# Altium project STM32F407_Board.PrjPcb (part 3 of 3)

## Sheet [9]-STM32F407.SchDoc
size A3; Organization: Altium Limited; Address1: L3, 12a Rodborough Rd; Address2: Frenchs Forest; Address3: NSW; Address4: Australia 2086
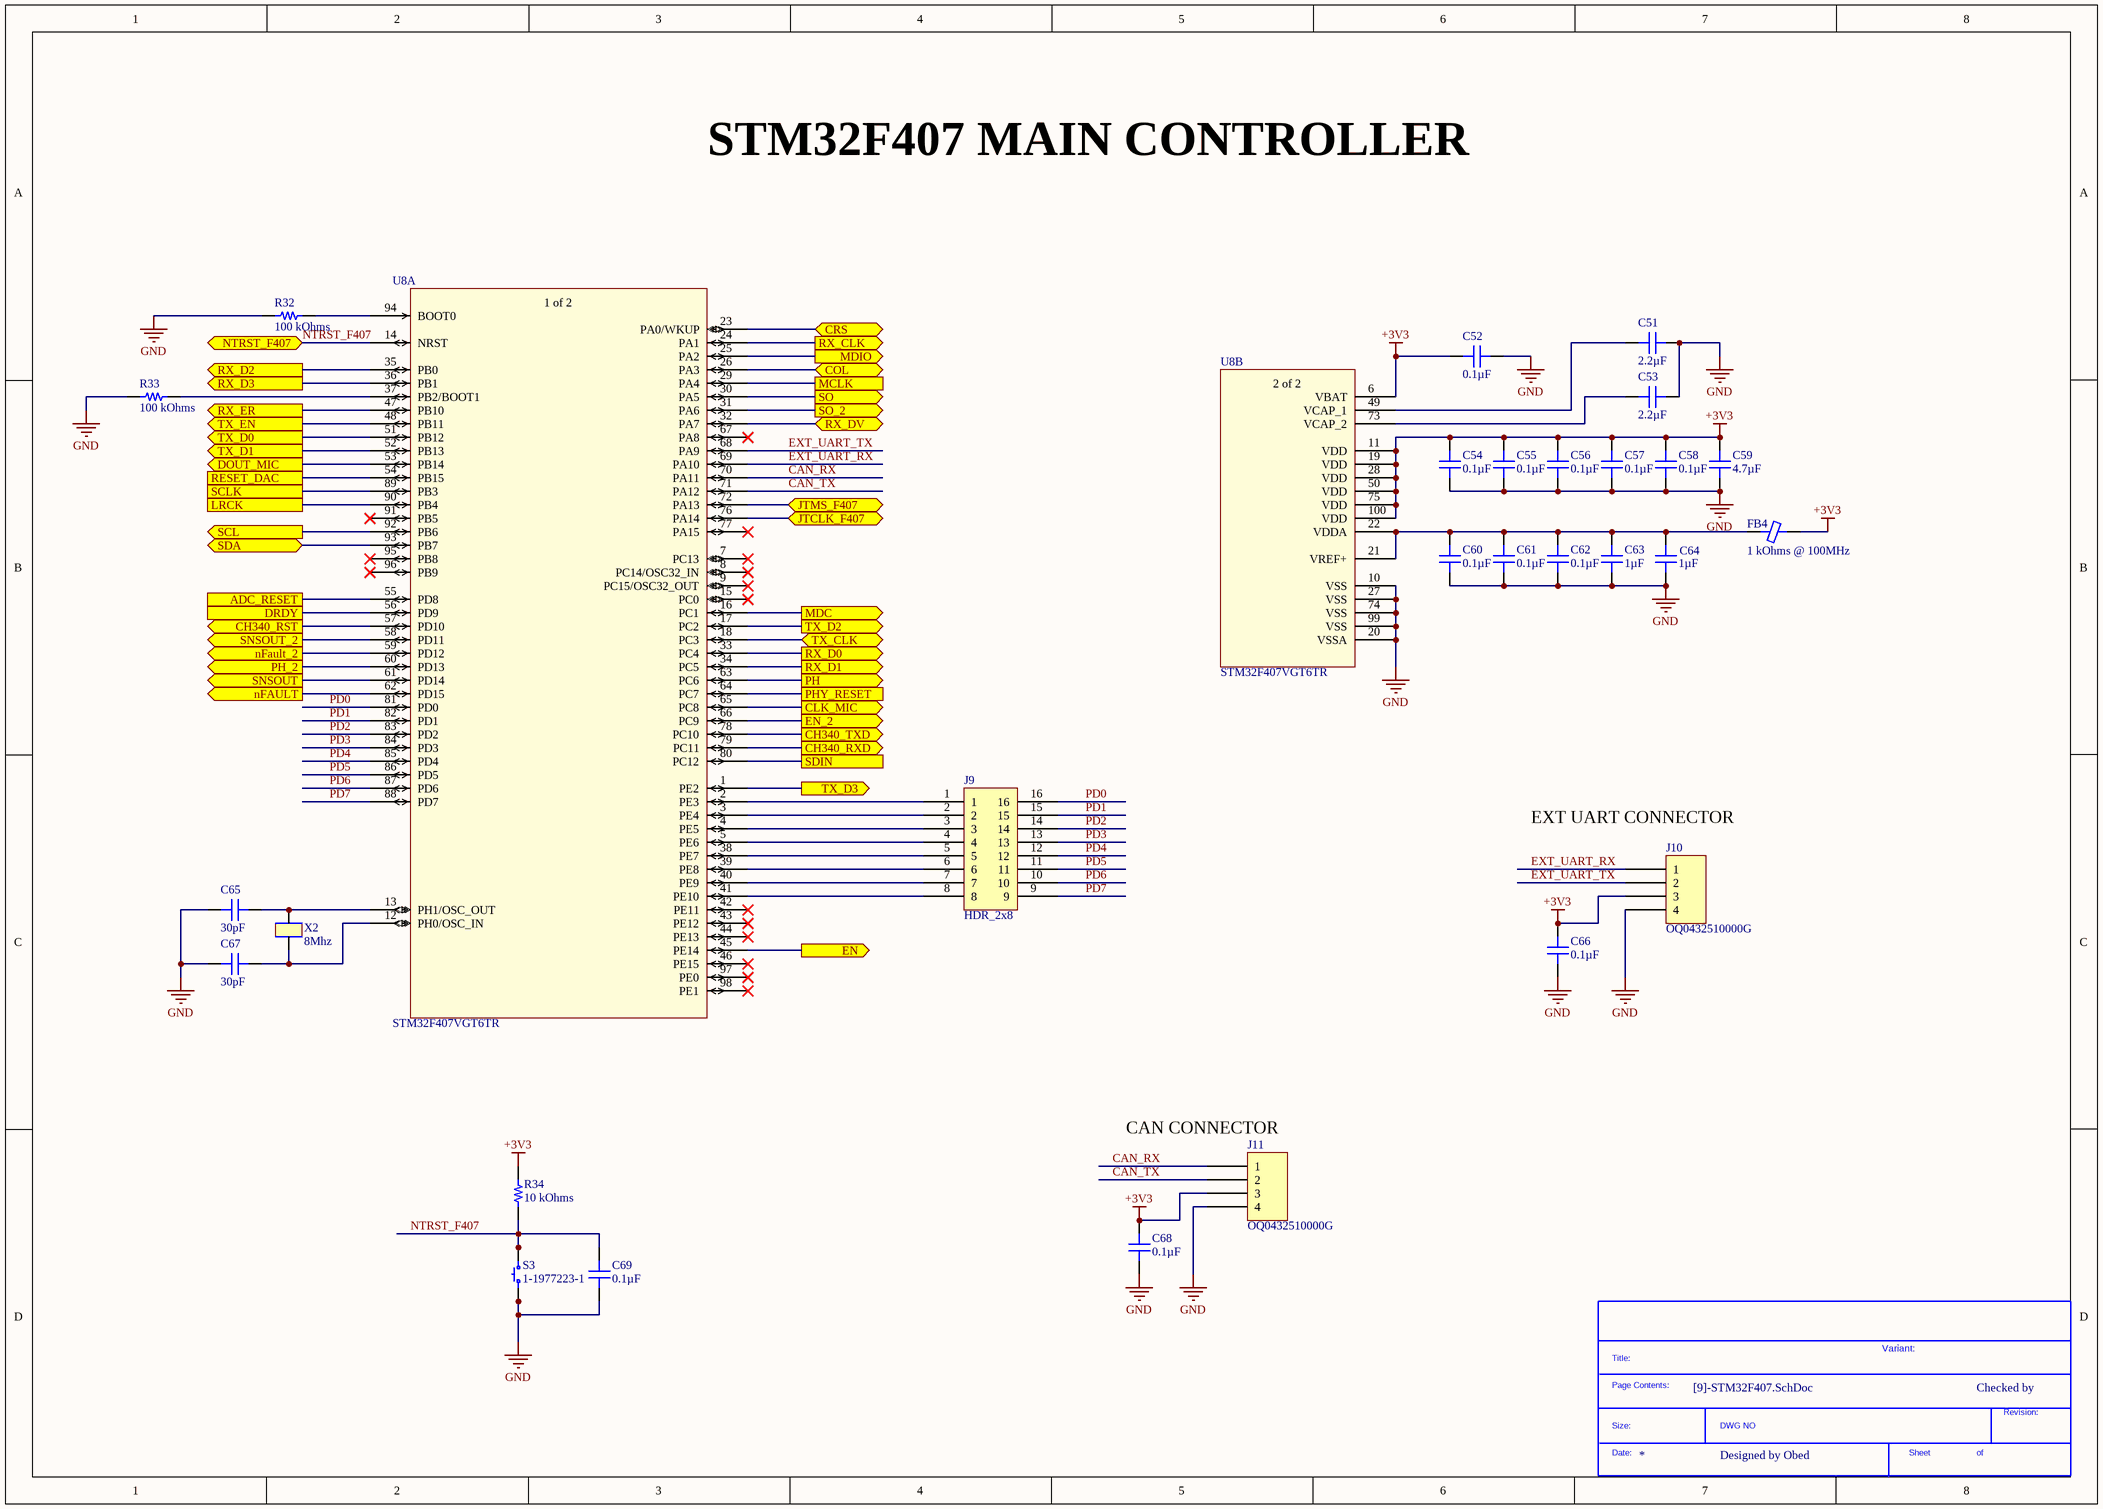
[diagram p8: [9]-STM32F407.SchDoc]

### Parts
(Parts that share a designator on the sheet are numbered #1, #2 ... from top to bottom, then left to right.)
*?#9  SDTitleBlock  (value not drawn)  (graphical)
C51  2.2µF  [CAP 0805_2012]
C52  0.1µF  [CAP 0805_2012]
C53  2.2µF  [CAP 0805_2012]
C54  0.1µF  [CAP 0805_2012]
C55  0.1µF  [CAP 0805_2012]
C56  0.1µF  [CAP 0805_2012]
C57  0.1µF  [CAP 0805_2012]
C58  0.1µF  [CAP 0805_2012]
C59  4.7µF  [CAP 0805_2012]
C60  0.1µF  [CAP 0805_2012]
C61  0.1µF  [CAP 0805_2012]
C62  0.1µF  [CAP 0805_2012]
C63  1µF  [CAP 0805_2012]
C64  1µF  [CAP 0805_2012]
C65  30pF  [CAP 0805_2012]
C66  0.1µF  [CAP 0805_2012]
C67  30pF  [CAP 0805_2012]
C68  0.1µF  [CAP 0805_2012]
C69  0.1µF  [CAP 0805_2012]
FB4  1 kOhms @ 100MHz  [FER 1206_3216]
J9  HDR_2x8  [HDR_2x8]
J10  OQ0432510000G  [FCI 06-381-4PIN]
J11  OQ0432510000G  [FCI 06-381-4PIN]
R32  100 kOhms  [RES 0603_1608]
R33  100 kOhms  [RES 0805_2012]
R34  10 kOhms  [RES 0805_2012]
S3  1-1977223-1  [TE FSM4JSMA]
U8  STM32F407VGT6TR  [QFN100_19.6_669_58X10_SMD]  (parts A,B of 2)
X2  8Mhz  [XTAL_314_240X47_SMD]

### Ports
ADC_RESET, CH340_RST (out), CH340_RXD (out), CH340_TXD (out), CLK_MIC (out), COL (bidir), CRS (bidir), DOUT_MIC (out), DRDY, EN (out), EN_2 (out), JTCLK_F407 (bidir), JTMS_F407 (bidir), LRCK, MCLK, MDC (out), MDIO (out), nFAULT (out), nFault_2 (out), NTRST_F407 (bidir), PH (out), PH_2 (out), PHY_RESET, RESET_DAC, RX_CLK (out), RX_D0 (out), RX_D1 (out), RX_D2 (out), RX_D3 (out), RX_DV (bidir), RX_ER (out), SCL (out), SCLK, SDA (bidir), SDIN, SNSOUT (out), SNSOUT_2 (out), SO (out), SO_2 (out), TX_CLK (bidir), TX_D0 (out), TX_D1 (out), TX_D2 (out), TX_D3 (out), TX_EN (out)

### Nets
+3V3: C52.1 C54.1 C55.1 C56.1 C57.1 C58.1 C59.2 C66.1 C68.1 FB4.2 J10.3 J11.3 R34.1 U8.6(VBAT) U8.11(VDD) U8.19(VDD) U8.28(VDD) U8.50(VDD) U8.75(VDD) U8.100(VDD)
GND: C51.2 C52.2 C53.2 C54.2 C55.2 C56.2 C57.2 C58.2 C59.1 C60.2 C61.2 C62.2 C63.1 C64.1 C65.1 C66.2 C67.1 C68.2 C69.1 J10.4 J11.4 R32.1 R33.1 S3.1 S3.2 U8.10(VSS) U8.20(VSSA) U8.27(VSS) U8.74(VSS) U8.99(VSS)
CAN_RX: J11.1 U8.70(PA11)
CAN_TX: J11.2 U8.71(PA12)
COL: U8.26(PA3) ; port COL
CRS: U8.23(PA0/WKUP) ; port CRS
EXT_UART_RX: J10.1 U8.69(PA10)
EXT_UART_TX: J10.2 U8.68(PA9)
NTRST_F407: C69.2 R34.2 S3.3 S3.4 U8.14(NRST) ; port NTRST_F407
PD0: J9.16 U8.81(PD0)
PD1: J9.15 U8.82(PD1)
PD2: J9.14 U8.83(PD2)
PD3: J9.13 U8.84(PD3)
PD4: J9.12 U8.85(PD4)
PD5: J9.11 U8.86(PD5)
PD6: J9.10 U8.87(PD6)
PD7: J9.9 U8.88(PD7)
PHY_RESET: U8.64(PC7) ; port PHY_RESET
NetC51_1: C51.1 U8.49(VCAP_1)
NetC53_1: C53.1 U8.73(VCAP_2)
NetC60_1: C60.1 C61.1 C62.1 C63.2 C64.2 FB4.1 U8.21(VREF+) U8.22(VDDA)
NetC65_2: C65.2 U8.13(PH1/OSC_OUT) X2.2
NetC67_2: C67.2 U8.12(PH0/OSC_IN) X2.1
NetJ9_1: J9.1 U8.2(PE3)
NetJ9_2: J9.2 U8.3(PE4)
NetJ9_3: J9.3 U8.4(PE5)
NetJ9_4: J9.4 U8.5(PE6)
NetJ9_5: J9.5 U8.38(PE7)
NetJ9_6: J9.6 U8.39(PE8)
NetJ9_7: J9.7 U8.40(PE9)
NetJ9_8: J9.8 U8.41(PE10)
NetR8_2: U8.25(PA2) ; port MDIO
NetR19_1: U8.45(PE14) ; port EN
NetR22_1: U8.62(PD15) ; port nFAULT
NetR23_1: U8.61(PD14) ; port SNSOUT
NetR24_2: U8.92(PB6) ; port SCL
NetR25_2: U8.93(PB7) ; port SDA
NetR26_1: U8.55(PD8) ; port ADC_RESET
NetR32_2: R32.2 U8.94(BOOT0)
NetR33_2: R33.2 U8.37(PB2/BOOT1)
NetR42_1: U8.66(PC9) ; port EN_2
NetR45_1: U8.59(PD12) ; port nFault_2
NetR46_1: U8.58(PD11) ; port SNSOUT_2
NetU1_18: U8.76(PA14) ; port JTCLK_F407
NetU1_25: U8.72(PA13) ; port JTMS_F407
NetU2_12: U8.16(PC1) ; port MDC
NetU2_13: U8.36(PB1) ; port RX_D3
NetU2_14: U8.35(PB0) ; port RX_D2
NetU2_15: U8.34(PC5) ; port RX_D1
NetU2_16: U8.33(PC4) ; port RX_D0
NetU2_18: U8.32(PA7) ; port RX_DV
NetU2_19: U8.24(PA1) ; port RX_CLK
NetU2_20: U8.47(PB10) ; port RX_ER
NetU2_22: U8.18(PC3) ; port TX_CLK
NetU2_23: U8.48(PB11) ; port TX_EN
NetU2_24: U8.51(PB12) ; port TX_D0
NetU2_25: U8.52(PB13) ; port TX_D1
NetU2_26: U8.17(PC2) ; port TX_D2
NetU2_27: U8.1(PE2) ; port TX_D3
NetU3_11: U8.30(PA5) ; port SO
NetU3_15: U8.63(PC6) ; port PH
NetU4_2: U8.78(PC10) ; port CH340_TXD
NetU4_3: U8.79(PC11) ; port CH340_RXD
NetU4_14: U8.57(PD10) ; port CH340_RST
NetU5_14: U8.56(PD9) ; port DRDY
NetU6_32: U8.54(PB15) ; port RESET_DAC
NetU6_37: U8.29(PA4) ; port MCLK
NetU6_38: U8.89(PB3) ; port SCLK
NetU6_39: U8.80(PC12) ; port SDIN
NetU6_40: U8.90(PB4) ; port LRCK
NetU7_3: U8.65(PC8) ; port CLK_MIC
NetU7_4: U8.53(PB14) ; port DOUT_MIC
NetU8_31: U8.31(PA6) ; port SO_2
NetU8_60: U8.60(PD13) ; port PH_2

Not connected (* = marked no-connect by the designer): U8 7(PC13)* 8(PC14/OSC32_IN)* 9(PC15/OSC32_OUT)* 15(PC0)* 42(PE11)* 43(PE12)* 44(PE13)* 46(PE15)* 67(PA8)* 77(PA15)* 91(PB5)* 95(PB8)* 96(PB9)* 97(PE0)* 98(PE1)*

### Notes on the sheet
- STM32F407 MAIN CONTROLLER
- (near J10) EXT UART CONNECTOR
- (near J11) CAN CONNECTOR
- Variant:
- Checked by
- Designed by Obed
- Title
- Size:
- Date:
- File:
- A2
- Number:
- Time:
- Revision:
- Sheet
- of
- (in symbol IC_STM32F407VGT6TR, part A) 1 of 2
- (in symbol IC_STM32F407VGT6TR, part B) 2 of 2
- (in symbol SDTitleBlock) Title:; Page Contents:; Revision:; Size:; DWG NO; Date:; Sheet; of

### Library data of the parts
C51 C53 = 08053C225MAT2A: CAP CER 2.2UF 25V X7R 0805; Manufacturer: AVX Corporation; Tolerance: ±20%; Part Number: 08053C225MAT2A; Value: 2.2µF; Applications: General Purpose; Capacitance: 2.2µF; ComponentLink1Description: Datasheet; ComponentLink1URL: http://datasheets.avx.com/X7RDielectric.pdf; ComponentLink2Description: DigiKey Link; ComponentLink2URL: http://digikey.com/product-detail/en/avx-corporation/08053C225MAT2A/478-10489-1-ND/6797614; Device Package: 0805 (2012 Metric); LastUpdated: 9/2/2020 01:04:11; Lifecycle Status: Active; Minimum Order: 1; Mounting Type: Surface Mount, MLCC; Operating Temperature: -55°C ~ 125°C; Package / Case: 0805 (2012 Metric); Packaging: TapeAndReel; PartId: 16805; Part Status: Active; Price: 0.09; Series: -; Size / Dimension: 0.079" L x 0.049" W (2.01mm x 1.25mm); Supplier 1: DigiKey; Supplier Part Number 1: 478-10489-1-ND; Temperature Coefficient: X7R; Thickness (Max): 0.060" (1.52mm); Voltage - Rated: 25V
C52 C54-C58 C60-C62 C66 C68 C69 = 0805J0500104KXT: CAP CER 0.1UF 50V X7R 0805; Manufacturer: Knowles Syfer; Tolerance: ±10%; Part Number: 0805J0500104KXT; Value: 0.1µF; Applications: General Purpose; Capacitance: 0.1µF; ComponentLink1Description: Datasheet; ComponentLink1URL: https://www.knowlescapacitors.com/getattachment/2dbfc8bc-e2b3-4b4d-afb1-43b011b9ebe0/High-Std-Voltage.aspx; ComponentLink2Description: DigiKey Link; ComponentLink2URL: http://digikey.com/product-detail/en/knowles-syfer/0805J0500104KXT/1608-1000-1-ND/5730199; Device Package: 0805 (2012 Metric); LastUpdated: 02/09/2020 01:04:31; Lifecycle Status: Active; Minimum Order: 1; Mounting Type: Surface Mount, MLCC; Operating Temperature: -55°C ~ 125°C; Package / Case: 0805 (2012 Metric); Packaging: TapeAndReel; PartId: 8322; Part Status: Active; Price: 0.17; Series: -; Size / Dimension: 0.079" L x 0.049" W (2.00mm x 1.25mm); Supplier 1: DigiKey; Supplier Part Number 1: 1608-1000-1-ND; Temperature Coefficient: X7R; Thickness (Max): 0.051" (1.30mm); Voltage - Rated: 50V
C59 = C2012JB1H475K125AB: CAP CER 4.7UF 50V JB 0805; Manufacturer: TDK Corporation; Tolerance: ±10%; Part Number: C2012JB1H475K125AB; Value: 4.7µF; Applications: General Purpose; Capacitance: 4.7µF; ComponentLink1Description: Datasheet; ComponentLink1URL: https://product.tdk.com/info/en/catalog/datasheets/mlcc_commercial_general_en.pdf?ref_disty=digikey; ComponentLink2Description: DigiKey Link; ComponentLink2URL: http://digikey.com/product-detail/en/tdk-corporation/C2012JB1H475K125AB/445-11510-1-ND/3953176; Device Package: 0805 (2012 Metric); Features: Low ESL; LastUpdated: 02/09/2020 01:04:16; Lifecycle Status: Active; Minimum Order: 1; Mounting Type: Surface Mount, MLCC; Operating Temperature: -25°C ~ 85°C; Package / Case: 0805 (2012 Metric); Packaging: TapeAndReel; PartId: 15333; Part Status: Active; Price: 0.18; Series: C; Size / Dimension: 0.079" L x 0.049" W (2.00mm x 1.25mm); Supplier 1: DigiKey; Supplier Part Number 1: 445-11510-1-ND; Temperature Coefficient: JB; Thickness (Max): 0.057" (1.45mm); Voltage - Rated: 50V
C63 C64 = 0805BB105K250YT: CAP CER 1UF 25V X7R 0805; Manufacturer: Knowles Novacap; Tolerance: ±10%; Part Number: 0805BB105K250YT; Value: 1µF; Applications: General Purpose; Capacitance: 1µF; ComponentLink1Description: Datasheet; ComponentLink1URL: https://www.knowlescapacitors.com/getattachment/6c8d48ef-fc2b-4752-ae2c-ce6c208de0c4/High-Capacitance-Chip.aspx; ComponentLink2Description: DigiKey Link; ComponentLink2URL: http://digikey.com/product-detail/en/knowles-novacap/0805BB105K250YT/1763-1195-1-ND/7304292; Device Package: 0805 (2012 Metric); LastUpdated: 9/2/2020 01:04:39; Lifecycle Status: Active; Minimum Order: 1; Mounting Type: Surface Mount, MLCC; Operating Temperature: -55°C ~ 125°C; Package / Case: 0805 (2012 Metric); Packaging: TapeAndReel; PartId: 4178; Part Status: Active; Price: 0.89; Series: -; Size / Dimension: 0.080" L x 0.050" W (2.03mm x 1.27mm); Supplier 1: DigiKey; Supplier Part Number 1: 1763-1195-1-ND; Temperature Coefficient: X7R; Thickness (Max): 0.054" (1.37mm); Voltage - Rated: 25V
C65 C67 = C0805C300F5GAC7800: CAP CER 30PF 50V NP0 0805; Manufacturer: KEMET; Temperature Coefficient: C0G, NP0; Tolerance: ±1%; Part Number: C0805C300F5GAC7800; Value: 30pF; Applications: General Purpose; Capacitance: 30pF; ComponentLink1Description: Datasheet; ComponentLink1URL: https://api.kemet.com/component-edge/download/datasheet/C0805C300F5GACTU.pdf; ComponentLink2Description: DigiKey Link; ComponentLink2URL: http://digikey.com/product-detail/en/kemet/C0805C300F5GAC7800/399-14586-1-ND/7103878; Device Package: 0805 (2012 Metric); Features: Low ESL; LastUpdated: 02/09/2020 01:04:34; Lifecycle Status: Active; Minimum Order: 1; Mounting Type: Surface Mount, MLCC; Operating Temperature: -55°C ~ 125°C; Package / Case: 0805 (2012 Metric); Packaging: TapeAndReel; PartId: 7037; Part Status: Active; Price: 0.29; Series: SMD Comm C0G; Size / Dimension: 0.079" L x 0.049" W (2.00mm x 1.25mm); Supplier 1: DigiKey; Supplier Part Number 1: 399-14586-1-ND; Thickness (Max): 0.035" (0.88mm); Voltage - Rated: 50V
FB4 = BLM31KN102SZ1L: FERRITE BEAD 1 KOHM 1206 1LN; Manufacturer: Murata Electronics; Current Rating (Max): 2A; DC Resistance (DCR) (Max): 75mOhm; Filter Type: Power Line; Number of Lines: 1; Part Number: BLM31KN102SZ1L; ComponentLink1Description: Datasheet; ComponentLink1URL: https://www.murata.com/en-global/products/productdata/8796751200286/QNFA9115.pdf; ComponentLink2Description: DigiKey Link; ComponentLink2URL: http://digikey.com/product-detail/en/murata-electronics/BLM31KN102SZ1L/490-16522-1-ND/7564150; Device Package: 1206 (3216 Metric); Height (Max): 0.071" (1.80mm); Impedance @ Frequency: 1 kOhms @ 100MHz; LastUpdated: 02/09/2020 01:18:24; Lifecycle Status: Active; Minimum Order: 1; Mounting Type: Surface Mount; Operating Temperature: -55°C ~ 125°C; Package / Case: 1206 (3216 Metric); Packaging: TapeAndReel; PartId: 1565; Part Status: Active; Price: 0.10; Ratings: AEC-Q200; Series: BLM; Size / Dimension: 0.126" L x 0.063" W (3.20mm x 1.60mm); Supplier 1: DigiKey; Supplier Part Number 1: 490-16522-1-ND; Value: 1 kOhms @ 100MHz
J9 = HDR_2x8: CONN HDR FEMALE 16POS 0.1 GOLD PCB; Manufacturer: Sullins; Manufacturer Part Number: PPPC082LFBN-RC; Number of Positions: 16; Connector Type: Header; Pitch: 0.1inch; Supplier 1: Digi-Key; RoHS: Yes; Category: Connectors; Stock 1: 22838; Pricing 1: 1=1.03000, 10=0.90400, 100=0.78010, 500=0.63828, 1000=0.56736, 5000=0.51220 (USD); Mount: Through Hole; Color: Black; Contact Plating: Gold; Contact Material: Bronze; Housing Material: Plastic; Package Quantity: 1000; Number of Rows: 2; Packaging: Bulk; Termination: Solder; Contact Type: Female Socket; Length: 20.8mm; Width: 5mm; Height: 8.5mm; Row Spacing: 0.1inch; Lead Free: Lead Free; RoHS Compliant: Yes; ComponentLink1URL: https://media.digikey.com/pdf/Data%20Sheets/Sullins%20PDFs/Female_Headers.100_DS.pdf?src-supplier=Digi-Key; ComponentLink1Description: https://media.digikey.com/pdf/Data%20Sheets/Sullins%20PDFs/Female_Headers.100_DS.pdf?src-supplier=Digi-Key; ComponentLink2URL: http://www.sullinscorp.com/catalogs/101_Page80-81_HEADER_.100_2.54mm_FEMALE.pdf?src-supplier=Future+Electronics; ComponentLink2Description: http://www.sullinscorp.com/catalogs/101_Page80-81_HEADER_.100_2.54mm_FEMALE.pdf?src-supplier=Future+Electronics; Supplier Part Number 1: S7111-ND
J10 J11 = OQ0432510000G: TERM BLOCK HDR 4POS 90DEG 3.81MM; Manufacturer: Amphenol Anytek; Current - UL: 10A; Header Orientation: 90°, Right Angle; Number of Levels: 1; Number of Positions: 4; Pitch: 0.150" (3.81mm); Voltage - UL: 300V; Part Number: OQ0432510000G; Color: Green; ComponentLink1Description: Datasheet; ComponentLink1URL: http://portal.fciconnect.com/Comergent//fci/drawing/oqxx32x100j0g.pdf; ComponentLink2Description: DigiKey Link; ComponentLink2URL: //digikey.com/product-detail/en/amphenol-anytek/OQ0432510000G/609-3821-ND/2261267; Contact Mating Finish: Tin; LastUpdated: 12/16/2019 19:15:03; Lifecycle Status: 0; Minimum Order: 1; Mounting Type: Through Hole; Operating Temperature: -40°C ~ 115°C; Packaging: Bulk; Part Status: Active; Positions Per Level: 4; Price: 0.71; Series: 06-381; Supplier 1: DigiKey; Supplier Part Number 1: 609-3821-ND; Termination Style: Solder; Type: Header, Male Pins, Shrouded (4 Side)
R32 = RT0603FRE07100KL: RES SMD 100K OHM 1% 1/10W 0603; Manufacturer: Yageo; Power (Watts): 0.1W, 1/10W; Temperature Coefficient: ±50ppm/°C; Part Number: RT0603FRE07100KL; Value: 100 kOhms; ComponentLink1Description: Datasheet; ComponentLink1URL: https://www.yageo.com/upload/media/product/productsearch/datasheet/rchip/PYu-RT_1-to-0.01_RoHS_L_11.pdf; ComponentLink2Description: DigiKey Link; ComponentLink2URL: http://digikey.com/product-detail/en/yageo/RT0603FRE07100KL/YAG2319CT-ND/5252433; Composition: Thin Film; Device Package: 0603 (1608 Metric); Height - Seated (Max): 0.022" (0.55mm); LastUpdated: 02/09/2020 01:10:23; Lifecycle Status: Active; Minimum Order: 1; Number of Terminations: 2; Operating Temperature: -55°C ~ 155°C; Package / Case: 0603 (1608 Metric); Packaging: TapeAndReel; PartId: 5677; Part Status: Active; Price: 0.01; Resistance: 100 kOhms; Series: RT; Size / Dimension: 0.063" L x 0.031" W (1.60mm x 0.80mm); Supplier 1: DigiKey; Supplier Part Number 1: YAG2319CT-ND; Supplier Device Package: 0603; Tolerance: ±1%
R33 = RMCF0805FG100K: RES 100K OHM 1% 1/8W 0805; Manufacturer: Stackpole Electronics Inc; Power (Watts): 0.125W, 1/8W; Temperature Coefficient: ±100ppm/°C; Part Number: RMCF0805FG100K; Value: 100 kOhms; ComponentLink1Description: Datasheet; ComponentLink1URL: https://www.seielect.com/catalog/sei-packaging.pdf; ComponentLink2Description: DigiKey Link; ComponentLink2URL: http://digikey.com/product-detail/en/stackpole-electronics-inc/RMCF0805FG100K/RMCF0805FG100KCT-ND/6053193; Composition: Thick Film; Device Package: 0805 (2012 Metric); Features: Automotive AEC-Q200; Height - Seated (Max): 0.026" (0.65mm); LastUpdated: 9/2/2020 01:15:10; Lifecycle Status: Active; Minimum Order: 1; Number of Terminations: 2; Operating Temperature: -55°C ~ 155°C; Package / Case: 0805 (2012 Metric); Packaging: CutTape; PartId: 34072; Part Status: Active; Price: 0.10; Ratings: AEC-Q200; Resistance: 100 kOhms; Series: RMCF; Size / Dimension: 0.079" L x 0.049" W (2.00mm x 1.25mm); Supplier 1: DigiKey; Supplier Part Number 1: RMCF0805FG100KCT-ND; Supplier Device Package: 0805; Tolerance: ±1%
R34 = CRCW080510K0FKEA: RES SMD 10K OHM 1% 1/8W 0805; Manufacturer: Vishay Dale; Power (Watts): 0.125W, 1/8W; Temperature Coefficient: ±100ppm/°C; Part Number: CRCW080510K0FKEA; Value: 10 kOhms; ComponentLink1Description: Datasheet; ComponentLink1URL: http://www.vishay.com/docs/20035/dcrcwe3.pdf; ComponentLink2Description: DigiKey Link; ComponentLink2URL: http://digikey.com/product-detail/en/vishay-dale/CRCW080510K0FKEA/541-10.0KCCT-ND/1180897; Composition: Thick Film; Device Package: 0805 (2012 Metric); Features: Automotive AEC-Q200; Height - Seated (Max): 0.020" (0.50mm); LastUpdated: 02/09/2020 01:15:23; Lifecycle Status: Active; Minimum Order: 1; Number of Terminations: 2; Operating Temperature: -55°C ~ 155°C; Package / Case: 0805 (2012 Metric); Packaging: TapeAndReel; PartId: 28101; Part Status: Active; Price: 0.01; Ratings: AEC-Q200; Resistance: 10 kOhms; Series: CRCW; Size / Dimension: 0.079" L x 0.049" W (2.00mm x 1.25mm); Supplier 1: DigiKey; Supplier Part Number 1: 541-10.0KCCT-ND; Supplier Device Package: 0805; Tolerance: ±1%
S3 = 1-1977223-1: SWITCH TACTILE SPST-NO 0.05A 24V; Manufacturer: TE Connectivity ALCOSWITCH Switches; Actuator Height off PCB, Vertical: 5.00mm; Actuator Orientation: Top Actuated; Actuator Type: Standard; Contact Rating @ Voltage: 0.05A @ 24VDC; Illumination: Non-Illuminated; Operating Force: 260gf; Outline: 6.00mm x 6.00mm; Switch Function: Off-Mom; Part Number: 1-1977223-1; Circuit: SPST-NO; ComponentLink1Description: Datasheet; ComponentLink1URL: https://www.te.com/commerce/DocumentDelivery/DDEController?Action=srchrtrv&DocNm=1308111-1_SWITCHES_CORE_PROGRAM_CATALOG&DocType=CS&DocLang=English; ComponentLink2Description: DigiKey Link; ComponentLink2URL: http://digikey.com/product-detail/en/te-connectivity-alcoswitch-switches/1-1977223-1/1-1977223-1-ND/5597032; LastUpdated: 02/09/2020 01:27:07; Lifecycle Status: Active; Minimum Order: 0; Mounting Type: Surface Mount; Price: 0; Series: FSMJSMA; Supplier 1: DigiKey; Supplier Part Number 1: 1-1977223-1-ND; Termination Style: Gull Wing
U8 = IC_STM32F407VGT6TR: STM32F Series 1 MB Flash 192 kB RAM ARM Based 32-Bit Microcontroller - LQFP-100; Manufacturer: STMicroelectronics; Number of I/Os: 82; Supplier 1: Digi-Key; Manufacturer Part Number: STM32F407VGT6TR; Category: Microcontrollers; Pricing 1: 1=13.51000, 10=12.41300, 25=11.89840, 100=10.48360, 250=9.96904, 500=9.37948 (USD); Case/Package: LQFP; Number of Pins: 100; Packaging: Tape and Reel; ComponentLink1URL: https://datasheet.ciiva.com/46384/1719442-46384038.pdf?src-supplier=Element14; ComponentLink1Description: https://datasheet.ciiva.com/46384/1719442-46384038.pdf?src-supplier=Element14; ComponentLink2URL: https://datasheet.ciiva.com/29719/dm00037051-29719319.pdf?src-supplier=Digi-Key; ComponentLink2Description: https://datasheet.ciiva.com/29719/dm00037051-29719319.pdf?src-supplier=Digi-Key; ComponentLink3URL: https://datasheet.ciiva.com/22692/1719442-22692042.pdf?src-supplier=Element14; ComponentLink3Description: https://datasheet.ciiva.com/22692/1719442-22692042.pdf?src-supplier=Element14; ComponentLink4URL: https://datasheet.ciiva.com/12270/dm00037051-492832-12270799.pdf?src-supplier=Mouser; ComponentLink4Description: https://datasheet.ciiva.com/12270/dm00037051-492832-12270799.pdf?src-supplier=Mouser; Supplier Part Number 1: 497-17437-6-ND
X2 = XTAL_8MHZ-ECS-80-32-5PX-SMD: CRYSTAL 8.0000MHZ 32PF SMD; Manufacturer: ECS International; Manufacturer Part Number: ECS-80-32-5PX-TR; Supplier 1: Digi-Key; Category: Crystals; Stock 1: 1261; Pricing 1: 1=0.45000, 10=0.37500, 50=0.33760, 100=0.30000, 500=0.28500 (USD); Packaging: Tape and Reel; ComponentLink1URL: https://datasheet.ciiva.com/852/csm-7x-852413.pdf?src-supplier=Digi-Key; ComponentLink1Description: https://datasheet.ciiva.com/852/csm-7x-852413.pdf?src-supplier=Digi-Key; ComponentLink2URL: https://datasheet.ciiva.com/852/csm-7x-852414.pdf?src-supplier=Digi-Key; ComponentLink2Description: https://datasheet.ciiva.com/852/csm-7x-852414.pdf?src-supplier=Digi-Key; ComponentLink3URL: https://datasheet.ciiva.com/852/csm-7x-852415.pdf?src-supplier=Digi-Key; ComponentLink3Description: https://datasheet.ciiva.com/852/csm-7x-852415.pdf?src-supplier=Digi-Key; Supplier Part Number 1: XC1272CT-ND

## Sheet [10]-POWER.SchDoc
size A4; Organization: Altium Limited; Address1: L3, 12a Rodborough Rd; Address2: Frenchs Forest; Address3: NSW; Address4: Australia 2086
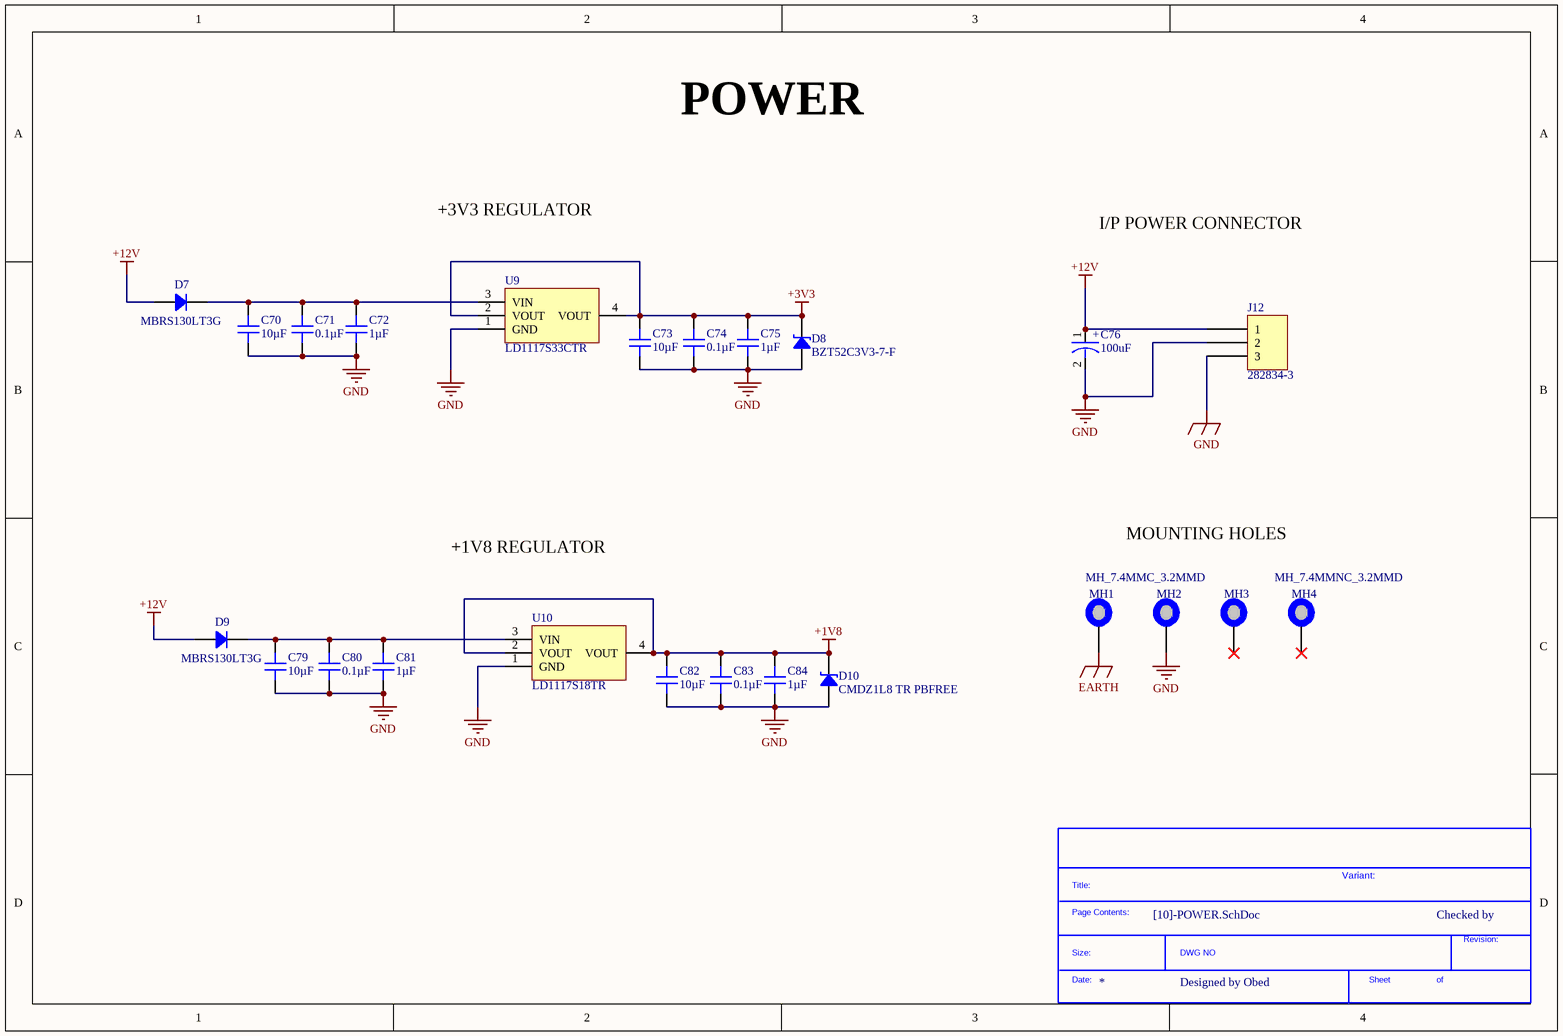
[diagram p9: [10]-POWER.SchDoc]

### Parts
(Parts that share a designator on the sheet are numbered #1, #2 ... from top to bottom, then left to right.)
*?#10  SDTitleBlock  (value not drawn)  (graphical)
C70  10µF  [CAP 1206_3216 - 1.8MM]
C71  0.1µF  [CAP 0805_2012]
C72  1µF  [CAP 0805_2012]
C73  10µF  [CAP 1206_3216 - 1.8MM]
C74  0.1µF  [CAP 0805_2012]
C75  1µF  [CAP 0805_2012]
C76  100uF  [ACAP_P305_D393_H393_RAD]
C79  10µF  [CAP 1206_3216 - 1.8MM]
C80  0.1µF  [CAP 0805_2012]
C81  1µF  [CAP 0805_2012]
C82  10µF  [CAP 1206_3216 - 1.8MM]
C83  0.1µF  [CAP 0805_2012]
C84  1µF  [CAP 0805_2012]
D7  MBRS130LT3G  [DO214AA SMB]
D8  BZT52C3V3-7-F  [SOD-123]
D9  MBRS130LT3G  [DO214AA SMB]
D10  CMDZ1L8 TR PBFREE  [SOD323]
J12  282834-3  [TE 282834-3]
MH1  MH_7.4MMC_3.2MMD  [MH_7.4MMC_3.2MMD]
MH2  MH_7.4MMC_3.2MMD  [MH_7.4MMC_3.2MMD]  (value not drawn)
MH3  MH_7.4MMC_3.2MMD  [MH_7.4MMC_3.2MMD]  (value not drawn)
MH4  MH_7.4MMNC_3.2MMD  [MH_7.4MM_3.2MMD_NON_COPPER_NPTH]
U9  LD1117S33CTR  [SOT223_3]
U10  LD1117S18TR  [SOT223_3]

### Nets
+1V8: C82.2 C83.1 C84.2 D10.2 U10.2(VOUT) U10.4(VOUT)
+3V3: C73.2 C74.1 C75.2 D8.2 U9.2(VOUT) U9.4(VOUT)
+12V: C76.1 D7.1 D9.1 J12.1
EARTH: MH1.1
GND: C70.1 C71.2 C72.1 C73.1 C74.2 C75.1 C76.2 C79.1 C80.2 C81.1 C82.1 C83.2 C84.1 D8.1 D10.1 J12.2 J12.3 MH2.1 U9.1(GND) U10.1(GND)
NetC70_2: C70.2 C71.1 C72.2 D7.2 U9.3(VIN)
NetC79_2: C79.2 C80.1 C81.2 D9.2 U10.3(VIN)

Not connected (* = marked no-connect by the designer): MH3 1*; MH4 1*

### Notes on the sheet
- POWER
- +3V3 REGULATOR
- I/P POWER CONNECTOR
- +1V8 REGULATOR
- MOUNTING HOLES
- Variant:
- Checked by
- Designed by Obed
- Title
- Size:
- Date:
- A4
- Number:
- Time:
- Revision:
- Sheet
- of
- File:
- (in symbol CAP-P_100uF-50V-20%-RAD) +
- (in symbol SDTitleBlock) Title:; Page Contents:; Revision:; Size:; DWG NO; Date:; Sheet; of

### Library data of the parts
C70 C73 C79 C82 = 12065D106KAT2A: CAP CER 10UF 50V X5R 1206; Manufacturer: AVX Corporation; Tolerance: ±10%; Part Number: 12065D106KAT2A; Value: 10µF; Applications: General Purpose; Capacitance: 10µF; ComponentLink1Description: Datasheet; ComponentLink1URL: http://datasheets.avx.com/cx5r.pdf; ComponentLink2Description: DigiKey Link; ComponentLink2URL: http://digikey.com/product-detail/en/avx-corporation/12065D106KAT2A/478-9979-1-ND/6149060; Device Package: 1206 (3216 Metric); LastUpdated: 02/09/2020 01:05:35; Lifecycle Status: Active; Minimum Order: 1; Mounting Type: Surface Mount, MLCC; Operating Temperature: -55°C ~ 85°C; Package / Case: 1206 (3216 Metric); Packaging: TapeAndReel; PartId: 21345; Part Status: Active; Price: 0.16; Series: -; Size / Dimension: 0.126" L x 0.063" W (3.20mm x 1.60mm); Supplier 1: DigiKey; Supplier Part Number 1: 478-9979-1-ND; Temperature Coefficient: X5R; Thickness (Max): 0.071" (1.80mm); Voltage - Rated: 50V
C71 C74 C80 C83 = 0805J0500104KXT: as C52 on sheet [9]-STM32F407; Part Number: 0805J0500104KXT; Value: 0.1µF; Applications: General Purpose; Capacitance: 0.1µF; ComponentLink1Description: Datasheet; ComponentLink1URL: https://www.knowlescapacitors.com/getattachment/2dbfc8bc-e2b3-4b4d-afb1-43b011b9ebe0/High-Std-Voltage.aspx; ComponentLink2Description: DigiKey Link; ComponentLink2URL: http://digikey.com/product-detail/en/knowles-syfer/0805J0500104KXT/1608-1000-1-ND/5730199; Device Package: 0805 (2012 Metric); LastUpdated: 02/09/2020 01:04:31; Lifecycle Status: Active; Minimum Order: 1; Mounting Type: Surface Mount, MLCC; Operating Temperature: -55°C ~ 125°C; Package / Case: 0805 (2012 Metric); Packaging: TapeAndReel; PartId: 8322; Part Status: Active; Price: 0.17; Series: -; Size / Dimension: 0.079" L x 0.049" W (2.00mm x 1.25mm); Supplier 1: DigiKey; Supplier Part Number 1: 1608-1000-1-ND; Temperature Coefficient: X7R; Thickness (Max): 0.051" (1.30mm); Voltage - Rated: 50V
C72 C75 C81 C84 = 0805BB105K250YT: as C63 on sheet [9]-STM32F407; Part Number: 0805BB105K250YT; Value: 1µF; Applications: General Purpose; Capacitance: 1µF; ComponentLink1Description: Datasheet; ComponentLink1URL: https://www.knowlescapacitors.com/getattachment/6c8d48ef-fc2b-4752-ae2c-ce6c208de0c4/High-Capacitance-Chip.aspx; ComponentLink2Description: DigiKey Link; ComponentLink2URL: http://digikey.com/product-detail/en/knowles-novacap/0805BB105K250YT/1763-1195-1-ND/7304292; Device Package: 0805 (2012 Metric); LastUpdated: 9/2/2020 01:04:39; Lifecycle Status: Active; Minimum Order: 1; Mounting Type: Surface Mount, MLCC; Operating Temperature: -55°C ~ 125°C; Package / Case: 0805 (2012 Metric); Packaging: TapeAndReel; PartId: 4178; Part Status: Active; Price: 0.89; Series: -; Size / Dimension: 0.080" L x 0.050" W (2.03mm x 1.27mm); Supplier 1: DigiKey; Supplier Part Number 1: 1763-1195-1-ND; Temperature Coefficient: X7R; Thickness (Max): 0.054" (1.37mm); Voltage - Rated: 25V
C76 = CAP-P_100uF-50V-20%-RAD: Cap, Aec-Q200, 100Uf, 50V, Alu Elec, Smd Rohs Compliant: Yes; Manufacturer: KEMET; Manufacturer Part Number: A768MS107M1HLAV024; Pricing 1: 2500=1.10647 (USD); Supplier 1: Digi-Key; Supplier Part Number 1: C317C622F5G5TA7301-ND
D7 D9 = MBRS130LT3G: DIODE SCHOTTKY 30V 2A SMB; Manufacturer: ON Semiconductor; Current - Reverse Leakage @ Vr: 1mA @ 30V; Speed: Fast Recovery =< 500ns, > 200mA (Io); Voltage - Forward (Vf) (Max) @ If: 445mV @ 2A; Part Number: MBRS130LT3G; ComponentLink1Description: Datasheet; ComponentLink1URL: https://www.onsemi.com/pub/Collateral/MBRS130LT3-D.PDF; ComponentLink2Description: DigiKey Link; ComponentLink2URL: http://digikey.com/product-detail/en/on-semiconductor/MBRS130LT3G/MBRS130LT3GOSCT-ND/918000; Current - Average Rectified (Io): 2A; Diode Type: Schottky; LastUpdated: 9/2/2020 01:18:53; Lifecycle Status: Active; Minimum Order: 1; Mounting Type: Surface Mount; Operating Temperature - Junction: -65°C ~ 125°C; Package / Case: DO-214AA, SMB; Packaging: TapeAndReel; PartId: 1388; Part Status: Active; Price: 0.09; Series: -; Supplier 1: DigiKey; Supplier Part Number 1: MBRS130LT3GOSCT-ND; Supplier Device Package: SMB; Voltage - DC Reverse (Vr) (Max): 30V
D8 = BZT52C3V3-7-F: DIODE ZENER 3.3V 500MW SOD123; Manufacturer: Diodes Incorporated; Current - Reverse Leakage @ Vr: 5µA @ 1V; Impedance (Max) (Zzt): 95 Ohms; Tolerance: ±6%; Voltage - Forward (Vf) (Max) @ If: 900mV @ 10mA; Part Number: BZT52C3V3-7-F; ComponentLink1Description: Datasheet; ComponentLink1URL: https://www.diodes.com/assets/Datasheets/ds18004.pdf; ComponentLink2Description: DigiKey Link; ComponentLink2URL: http://digikey.com/product-detail/en/diodes-incorporated/BZT52C3V3-7-F/BZT52C3V3-FDICT-ND/717854; LastUpdated: 9/2/2020 01:19:25; Lifecycle Status: Active; Minimum Order: 1; Mounting Type: Surface Mount; Operating Temperature: -65°C ~ 150°C; Package / Case: SOD-123; Packaging: TapeAndReel; PartId: 2214; Part Status: Active; Power - Max: 500mW; Price: 0.04; Series: -; Supplier 1: DigiKey; Supplier Part Number 1: BZT52C3V3-FDICT-ND; Supplier Device Package: SOD-123; Voltage - Zener (Nom) (Vz): 3.3V
D10 = CMDZ1L8 TR PBFREE: DIODE ZENER 1.8V 250MW SOD323; Manufacturer: Central Semiconductor Corp; Current - Reverse Leakage @ Vr: 25µA @ 1V; Impedance (Max) (Zzt): 1.2 kOhms; Tolerance: ±5%; Voltage - Forward (Vf) (Max) @ If: 900mV @ 10mA; Part Number: CMDZ1L8 TR PBFREE; ComponentLink1Description: Datasheet; ComponentLink1URL: https://my.centralsemi.com/get_document.php?cmp=1&mergetype=pd&mergepath=pd&pdf_id=CMDZ5L1-36L.PDF; ComponentLink2Description: DigiKey Link; ComponentLink2URL: http://digikey.com/product-detail/en/central-semiconductor-corp/CMDZ1L8-TR-PBFREE/1514-CMDZ1L8TRPBFREECT-ND/5324426; LastUpdated: 9/2/2020 01:27:30; Lifecycle Status: Active; Minimum Order: 1; Mounting Type: Surface Mount; Operating Temperature: -65°C ~ 150°C; Package / Case: SC-76, SOD-323; Packaging: TapeAndReel; PartId: 3515; Part Status: Active; Power - Max: 250mW; Price: 0.10; Series: -; Supplier 1: DigiKey; Supplier Part Number 1: 1514-CMDZ1L8TRPBFREECT-ND; Supplier Device Package: SOD-323; Voltage - Zener (Nom) (Vz): 1.8V
J12 = 282834-3: TERM BLK 3P SIDE ENT 2.54MM PCB; Manufacturer: TE Connectivity AMP Connectors; Current: 10A; Mating Orientation: Horizontal with Board; Number of Levels: 1; Pitch: 0.100" (2.54mm); Positions Per Level: 3; Voltage: 150V; Wire Gauge: 16-30 AWG; Wire Termination: Screw - Rising Cage Clamp; Part Number: 282834-3; Color: Green; ComponentLink1Description: Datasheet; ComponentLink1URL: https://www.te.com/commerce/DocumentDelivery/DDEController?Action=srchrtrv&DocNm=282834&DocType=Customer+Drawing&DocLang=English; ComponentLink2Description: DigiKey Link; ComponentLink2URL: http://digikey.com/product-detail/en/te-connectivity-amp-connectors/282834-3/A98334-ND/1153264; LastUpdated: 1/15/2020 04:15:50; Lifecycle Status: Active; Minimum Order: 1; Mounting Type: Through Hole; Packaging: Bulk; Part Status: Active; Price: 2.01; Series: Buchanan; Supplier 1: DigiKey; Supplier Part Number 1: A98334-ND
MH1-MH3 = MH_7.4MMC_3.2MMD: Mounting Hole 7.4mm Diameter, 3.2mm Dril
MH4 = MH_7.4MMNC_3.2MMD: Mounting Hole 7.4mm Diameter (Non Copper), 3.2mm Dril NPTH
U9 = REG_15V-3.3V-0.9A-12W-SOT223: Linear Voltage Regulator IC 1 Output 800mA SOT-223; Manufacturer: STMicroelectronics; Alternate Part Number-1: NA; Manufacturer Part Number: LD1117S33CTR; Case/Package: SOT223; Supplier-1: SP ROAD; Supplier Part Number-1: LD1117S33CTR
U10 = REG_15V-1.8V-0.8A-1.4W-SOT223: LDO Voltage Regulators 1.8V 0.8A Positive; Manufacturer: STMicroelectronics; Alternate Part Number-1: NA; Manufacturer Part Number: LD1117S18TR; Case/Package: SOT-223-3; Supplier-1: Mouser; Supplier Part Number-1: 511-LD1117S18-TR

## Sheet [11]-Motor Driver_DRV8701_2.SchDoc
size A4; Organization: Altium Limited; Address1: L3, 12a Rodborough Rd; Address2: Frenchs Forest; Address3: NSW; Address4: Australia 2086
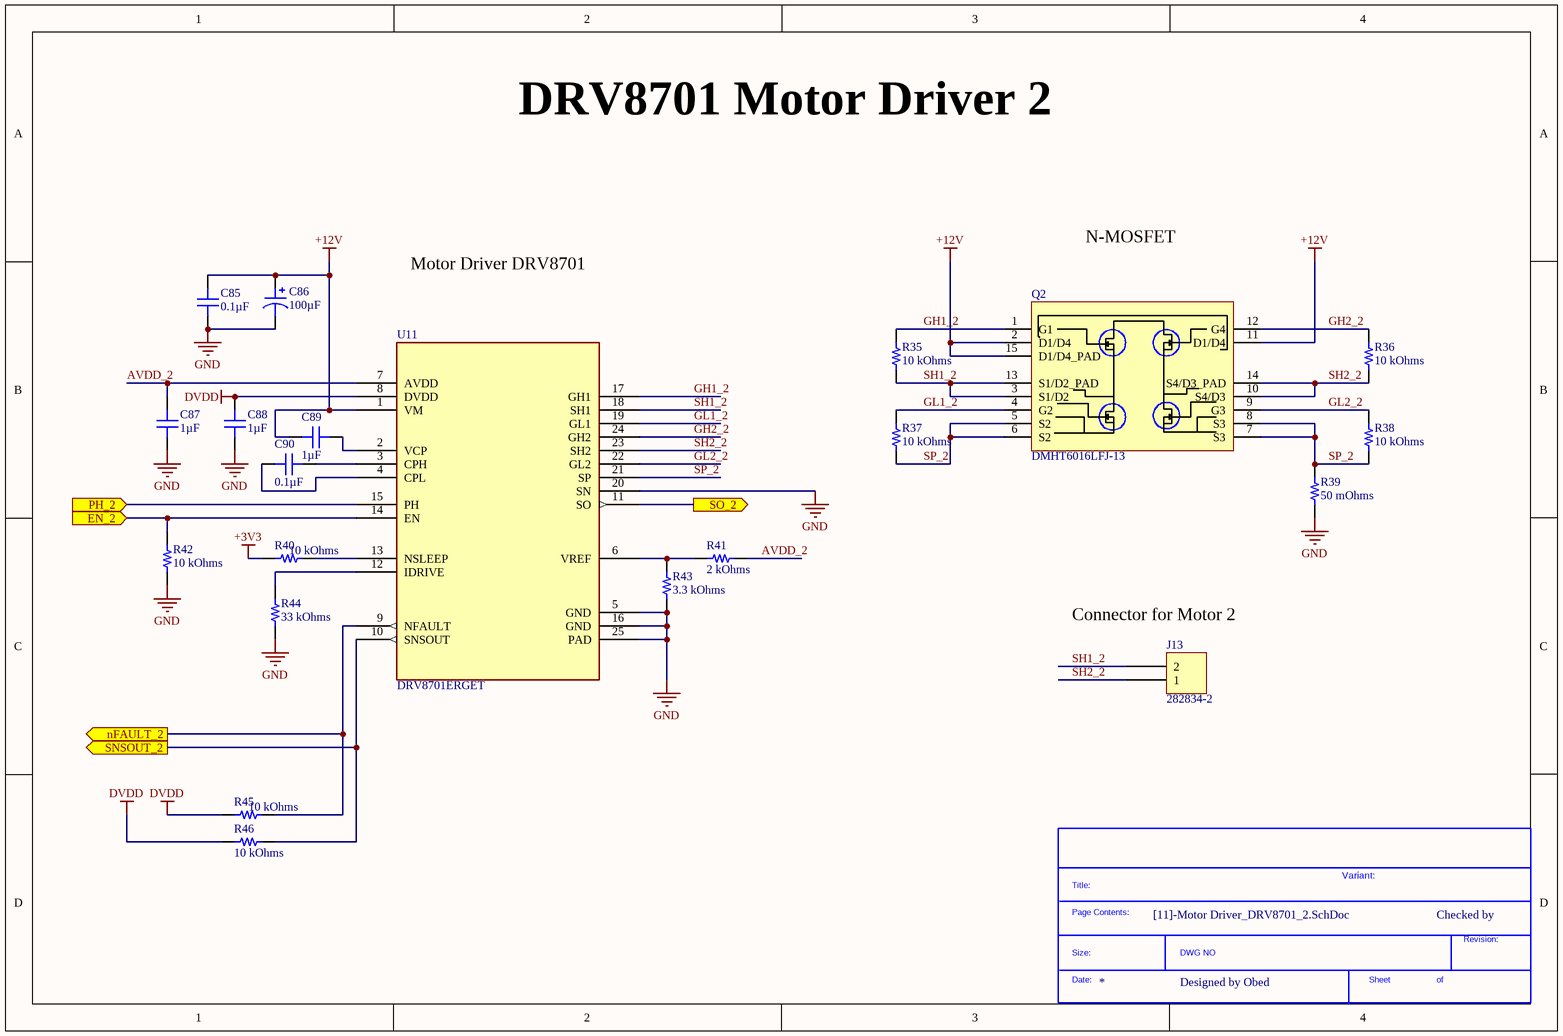
[diagram p10: [11]-Motor Driver_DRV8701_2.SchDoc]

### Parts
(Parts that share a designator on the sheet are numbered #1, #2 ... from top to bottom, then left to right.)
*?#11  SDTitleBlock  (value not drawn)  (graphical)
C85  0.1µF  [CAP 0805_2012]
C86  100µF  [CAP ALSMD 8.3MM H10.5MM]
C87  1µF  [CAP 0805_2012]
C88  1µF  [CAP 0805_2012]
C89  1µF  [CAP 0805_2012]
C90  0.1µF  [CAP 0805_2012]
J13  282834-2  [TE 282834-2]
Q2  DMHT6016LFJ-13  [DFN5045-12_33_212_27X15_SMD_1]
R35  10 kOhms  [RES 0805_2012]
R36  10 kOhms  [RES 0805_2012]
R37  10 kOhms  [RES 0805_2012]
R38  10 kOhms  [RES 0805_2012]
R39  50 mOhms  [RES 2512_6432]
R40  10 kOhms  [RES 0805_2012]
R41  2 kOhms  [RES 0603_1608]
R42  10 kOhms  [RES 0805_2012]
R43  3.3 kOhms  [RES 0603_1608]
R44  33 kOhms  [RES 0805_2012]
R45  10 kOhms  [RES 0805_2012]
R46  10 kOhms  [RES 0805_2012]
U11  DRV8701ERGET  [QFN50P400X400X100-25N]

### Ports
EN_2 (in), nFAULT_2 (out), PH_2 (in), SNSOUT_2 (out), SO_2 (out)

### Nets
+3V3: R40.2
+12V: C85.1 C86.1 C89.2 Q2.2(D1/D4) Q2.11(D1/D4) Q2.15(D1/D4_PAD) U11.1(VM)
DVDD: C88.2 R45.2 R46.2 U11.8(DVDD)
GND: C85.2 C86.2 C87.1 C88.1 R39.1 R42.2 R43.1 R44.1 U11.5(GND) U11.16(GND) U11.20(SN) U11.25(PAD)
AVDD_2: C87.2 R41.1 U11.7(AVDD)
GH1_2: Q2.1(G1) R35.2 U11.17(GH1)
GH2_2: Q2.12(G4) R36.2 U11.24(GH2)
GL1_2: Q2.4(G2) R37.2 U11.19(GL1)
GL2_2: Q2.9(G3) R38.2 U11.22(GL2)
SH1_2: J13.2 Q2.3(S1/D2) Q2.13(S1/D2_PAD) R35.1 U11.18(SH1)
SH2_2: J13.1 Q2.10(S4/D3) Q2.14(S4/D3_PAD) R36.1 U11.23(SH2)
SP_2: Q2.5(S2) Q2.6(S2) Q2.7(S3) Q2.8(S3) R37.1 R38.1 R39.2 U11.21(SP)
NetC89_1: C89.1 U11.2(VCP)
NetC90_1: C90.1 U11.3(CPH)
NetC90_2: C90.2 U11.4(CPL)
NetR40_1: R40.1 U11.13(NSLEEP)
NetR41_2: R41.2 R43.2 U11.6(VREF)
NetR42_1: R42.1 U11.14(EN) ; port EN_2
NetR44_2: R44.2 U11.12(IDRIVE)
NetR45_1: R45.1 U11.9(NFAULT) ; port nFAULT_2
NetR46_1: R46.1 U11.10(SNSOUT) ; port SNSOUT_2
NetU8_31: U11.11(SO) ; port SO_2
NetU8_60: U11.15(PH) ; port PH_2

### Notes on the sheet
- DRV8701 Motor Driver 2
- N-MOSFET
- Motor Driver DRV8701
- (near J13) Connector for Motor 2
- Variant:
- Checked by
- Designed by Obed
- Title
- Size:
- Date:
- File:
- A2
- Number:
- Time:
- Revision:
- Sheet
- of
- (in symbol SDTitleBlock) Title:; Page Contents:; Revision:; Size:; DWG NO; Date:; Sheet; of

### Library data of the parts
C85 C90 = 0805J0500104KXT: as C52 on sheet [9]-STM32F407; Part Number: 0805J0500104KXT; Value: 0.1µF; Applications: General Purpose; Capacitance: 0.1µF; ComponentLink1Description: Datasheet; ComponentLink1URL: https://www.knowlescapacitors.com/getattachment/2dbfc8bc-e2b3-4b4d-afb1-43b011b9ebe0/High-Std-Voltage.aspx; ComponentLink2Description: DigiKey Link; ComponentLink2URL: http://digikey.com/product-detail/en/knowles-syfer/0805J0500104KXT/1608-1000-1-ND/5730199; Device Package: 0805 (2012 Metric); LastUpdated: 02/09/2020 01:04:31; Lifecycle Status: Active; Minimum Order: 1; Mounting Type: Surface Mount, MLCC; Operating Temperature: -55°C ~ 125°C; Package / Case: 0805 (2012 Metric); Packaging: TapeAndReel; PartId: 8322; Part Status: Active; Price: 0.17; Series: -; Size / Dimension: 0.079" L x 0.049" W (2.00mm x 1.25mm); Supplier 1: DigiKey; Supplier Part Number 1: 1608-1000-1-ND; Temperature Coefficient: X7R; Thickness (Max): 0.051" (1.30mm); Voltage - Rated: 50V
C86 = EDT107M025A9MAA: CAP ALUM SMD 125C 100UF 25VDC; Manufacturer: KEMET; Lifetime @ Temp.: 2000 Hrs @ 125°C; Polarization: Polar; Ripple Current @ High Frequency: 156mA @ 10kHz; Ripple Current @ Low Frequency: 130mA @ 120Hz; Surface Mount Land Size: 0.327" L x 0.327" W (8.30mm x 8.30mm); Tolerance: ±20%; Voltage - Rated: 25V; Part Number: EDT107M025A9MAA; Applications: General Purpose; Capacitance: 100µF; ComponentLink1Description: Datasheet; ComponentLink1URL: https://api.kemet.com/component-edge/download/datasheet/EDT107M025A9MAA.pdf; ComponentLink2Description: DigiKey Link; ComponentLink2URL: http://digikey.com/product-detail/en/kemet/EDT107M025A9MAA/399-18156-1-ND/9354357; Device Package: Radial, Can - SMD; Height - Seated (Max): 0.413" (10.50mm); LastUpdated: 02/09/2020 01:25:14; Lifecycle Status: Active; Minimum Order: 1; Mounting Type: Surface Mount; Operating Temperature: -40°C ~ 125°C; Package / Case: Radial, Can - SMD; Packaging: TapeAndReel; PartId: 7637; Part Status: Active; Price: 0.23; Series: EDT; Size / Dimension: 0.315" Dia (8.00mm); Supplier 1: DigiKey; Supplier Part Number 1: 399-18156-1-ND; Value: 100µF
C87-C89 = 08055C105K4T2A: CAP CER 1UF 50V X7R 0805; Manufacturer: AVX Corporation; Tolerance: ±10%; Part Number: 08055C105K4T2A; Value: 1µF; Applications: Automotive; Capacitance: 1µF; ComponentLink1Description: Datasheet; ComponentLink1URL: http://datasheets.avx.com/AutoMLCC.pdf; ComponentLink2Description: DigiKey Link; ComponentLink2URL: http://digikey.com/product-detail/en/avx-corporation/08055C105K4T2A/478-9556-1-ND/5322894; Device Package: 0805 (2012 Metric); LastUpdated: 02/09/2020 01:04:35; Lifecycle Status: Active; Minimum Order: 1; Mounting Type: Surface Mount, MLCC; Operating Temperature: -55°C ~ 125°C; Package / Case: 0805 (2012 Metric); Packaging: TapeAndReel; PartId: 6460; Part Status: Active; Price: 0.08; Ratings: AEC-Q200; Series: -; Size / Dimension: 0.079" L x 0.049" W (2.00mm x 1.25mm); Supplier 1: DigiKey; Supplier Part Number 1: 478-9556-1-ND; Temperature Coefficient: X7R; Thickness (Max): 0.055" (1.40mm); Voltage - Rated: 50V
J13 = 282834-2: TERM BLK 2P SIDE ENT 2.54MM PCB; Manufacturer: TE Connectivity AMP Connectors; Current: 10A; Mating Orientation: Horizontal with Board; Number of Levels: 1; Pitch: 0.100" (2.54mm); Positions Per Level: 2; Voltage: 150V; Wire Gauge: 16-30 AWG; Wire Termination: Screw - Rising Cage Clamp; Part Number: 282834-2; Color: Green; ComponentLink1Description: Datasheet; ComponentLink1URL: https://www.te.com/commerce/DocumentDelivery/DDEController?Action=srchrtrv&DocNm=282834&DocType=Customer+Drawing&DocLang=English; ComponentLink2Description: DigiKey Link; ComponentLink2URL: http://digikey.com/product-detail/en/te-connectivity-amp-connectors/282834-2/A98333-ND/1150135; LastUpdated: 15/01/2020 04:15:38; Lifecycle Status: Active; Minimum Order: 1; Mounting Type: Through Hole; Packaging: Bulk; Part Status: Active; Price: 0.88; Series: Buchanan; Supplier 1: DigiKey; Supplier Part Number 1: A98333-ND
Q2 = MOSFET-N_60V-14.8A-V-DFN5045-12: Mosfet Array 4 N-Channel 14.8A (Ta) Surface Mount V-DFN5045-12; Manufacturer: Diodes; Supplier 1: Digi-Key; Manufacturer Part Number: DMHT6016LFJ-13; Category: MOSFETs; Pricing 1: 1=1.65000, 10=1.48400, 25=1.40040, 100=1.19310, 500=0.98020, 1000=0.81217 (USD); Mount: Surface Mount; Packaging: Tape and Reel; ComponentLink1URL: https://www.diodes.com/assets/Datasheets/DMHT6016LFJ.pdf?src-supplier=Digi-Key; ComponentLink1Description: https://www.diodes.com/assets/Datasheets/DMHT6016LFJ.pdf?src-supplier=Digi-Key; Supplier Part Number 1: DMHT6016LFJ-13DICT-ND
R35-R38 R40 R42 R45 R46 = CRCW080510K0FKEA: as R34 on sheet [9]-STM32F407; Part Number: CRCW080510K0FKEA; Value: 10 kOhms; ComponentLink1Description: Datasheet; ComponentLink1URL: http://www.vishay.com/docs/20035/dcrcwe3.pdf; ComponentLink2Description: DigiKey Link; ComponentLink2URL: http://digikey.com/product-detail/en/vishay-dale/CRCW080510K0FKEA/541-10.0KCCT-ND/1180897; Composition: Thick Film; Device Package: 0805 (2012 Metric); Features: Automotive AEC-Q200; Height - Seated (Max): 0.020" (0.50mm); LastUpdated: 02/09/2020 01:15:23; Lifecycle Status: Active; Minimum Order: 1; Number of Terminations: 2; Operating Temperature: -55°C ~ 155°C; Package / Case: 0805 (2012 Metric); Packaging: TapeAndReel; PartId: 28101; Part Status: Active; Price: 0.01; Ratings: AEC-Q200; Resistance: 10 kOhms; Series: CRCW; Size / Dimension: 0.079" L x 0.049" W (2.00mm x 1.25mm); Supplier 1: DigiKey; Supplier Part Number 1: 541-10.0KCCT-ND; Supplier Device Package: 0805; Tolerance: ±1%
R39 = PA2512FKF7W0R05E: METAL CURRENT SENSOR 2512 1% 100; Manufacturer: Yageo; Power (Watts): 2W; Temperature Coefficient: ±100ppm/°C; Part Number: PA2512FKF7W0R05E; ComponentLink1Description: Datasheet; ComponentLink1URL: http://www.yageo.com/documents/recent/PYu-PA_E_51_RoHS_10.pdf; ComponentLink2Description: DigiKey Link; ComponentLink2URL: http://digikey.com/product-detail/en/yageo/PA2512FKF7W0R05E/YAG6100CT-ND/9696554; Composition: Metal Element; Device Package: 2512 (6432 Metric); Features: Automotive AEC-Q200, Current Sense, Moisture Resistant; Height - Seated (Max): 0.035" (0.88mm); LastUpdated: 02/09/2020 01:26:58; Lifecycle Status: Active; Minimum Order: 1; Number of Terminations: 2; Operating Temperature: -55°C ~ 170°C; Package / Case: 2512 (6432 Metric); Packaging: TapeAndReel; Part Status: Active; Price: 0.20; Ratings: AEC-Q200; Resistance: 50 mOhms; Series: PA_E; Size / Dimension: 0.250" L x 0.125" W (6.35mm x 3.18mm); Supplier 1: DigiKey; Supplier Part Number 1: YAG6100CT-ND; Supplier Device Package: 2512; Tolerance: ±1%; Value: 50 mOhms
R41 = RMCF0603FT2K00: RES 2K OHM 1% 1/10W 0603; Manufacturer: Stackpole Electronics Inc; Power (Watts): 0.1W, 1/10W; Temperature Coefficient: ±100ppm/°C; Part Number: RMCF0603FT2K00; Value: 2 kOhms; ComponentLink1Description: Datasheet; ComponentLink1URL: https://www.seielect.com/catalog/sei-rmcf_rmcp.pdf; ComponentLink2Description: DigiKey Link; ComponentLink2URL: http://digikey.com/product-detail/en/stackpole-electronics-inc/RMCF0603FT2K00/RMCF0603FT2K00CT-ND/1943009; Composition: Thick Film; Device Package: 0603 (1608 Metric); Features: Automotive AEC-Q200; Height - Seated (Max): 0.022" (0.55mm); LastUpdated: 02/09/2020 01:10:22; Lifecycle Status: Active; Minimum Order: 1; Number of Terminations: 2; Operating Temperature: -55°C ~ 155°C; Package / Case: 0603 (1608 Metric); Packaging: CutTape; PartId: 6085; Part Status: Active; Price: 0.10; Ratings: AEC-Q200; Resistance: 2 kOhms; Series: RMCF; Size / Dimension: 0.061" L x 0.031" W (1.55mm x 0.80mm); Supplier 1: DigiKey; Supplier Part Number 1: RMCF0603FT2K00CT-ND; Supplier Device Package: 0603; Tolerance: ±1%
R43 = CRGP0603F3K3: CRGP 0603 3K3 1%; Manufacturer: TE Connectivity Passive Product; Power (Watts): 0.25W, 1/4W; Temperature Coefficient: ±100ppm/°C; Part Number: CRGP0603F3K3; Value: 3.3 kOhms; ComponentLink1Description: Datasheet; ComponentLink1URL: https://www.te.com/commerce/DocumentDelivery/DDEController?Action=srchrtrv&DocNm=9-1773463-9&DocType=DS&DocLang=English; ComponentLink2Description: DigiKey Link; ComponentLink2URL: http://digikey.com/product-detail/en/te-connectivity-passive-product/CRGP0603F3K3/A130422CT-ND/8578254; Composition: Thick Film; Device Package: 0603 (1608 Metric); Features: Pulse Withstanding; Height - Seated (Max): 0.022" (0.55mm); LastUpdated: 02/09/2020 01:10:24; Lifecycle Status: Active; Minimum Order: 1; Number of Terminations: 2; Operating Temperature: -55°C ~ 155°C; Package / Case: 0603 (1608 Metric); Packaging: TapeAndReel; PartId: 5037; Part Status: Active; Price: 0.02; Resistance: 3.3 kOhms; Series: CRGP; Size / Dimension: 0.063" L x 0.031" W (1.60mm x 0.80mm); Supplier 1: DigiKey; Supplier Part Number 1: A130422CT-ND; Supplier Device Package: 0603; Tolerance: ±1%
R44 = RMCF0805FT33K0: RES 33K OHM 1% 1/8W 0805; Manufacturer: Stackpole Electronics Inc; Power (Watts): 0.125W, 1/8W; Temperature Coefficient: ±100ppm/°C; Part Number: RMCF0805FT33K0; Value: 33 kOhms; ComponentLink1Description: Datasheet; ComponentLink1URL: https://www.seielect.com/catalog/sei-rmcf_rmcp.pdf; ComponentLink2Description: DigiKey Link; ComponentLink2URL: http://digikey.com/product-detail/en/stackpole-electronics-inc/RMCF0805FT33K0/RMCF0805FT33K0CT-ND/1942464; Composition: Thick Film; Device Package: 0805 (2012 Metric); Features: Automotive AEC-Q200; Height - Seated (Max): 0.026" (0.65mm); LastUpdated: 02/09/2020 01:15:14; Lifecycle Status: Active; Minimum Order: 1; Number of Terminations: 2; Operating Temperature: -55°C ~ 155°C; Package / Case: 0805 (2012 Metric); Packaging: CutTape; PartId: 32416; Part Status: Active; Price: 0.10; Ratings: AEC-Q200; Resistance: 33 kOhms; Series: RMCF; Size / Dimension: 0.079" L x 0.049" W (2.00mm x 1.25mm); Supplier 1: DigiKey; Supplier Part Number 1: RMCF0805FT33K0CT-ND; Supplier Device Package: 0805; Tolerance: ±1%
U11 = IC_DRV8701ERGET: IC MOTOR DRIVER 0V-5.5V 24VQFN; Manufacturer: Texas Instruments; Supplier 1: Digi-Key; Manufacturer Part Number: DRV8701ERGET; Category: Integrated Circuits (ICs); Pricing 1: 1=2.52000, 10=2.26100, 25=2.13320, 100=1.81750 (USD); Mount: Surface Mount; Case/Package: VQFN; ComponentLink1URL: http://www.ti.com/general/docs/lit/getliterature.tsp?genericPartNumber=DRV8701&&fileType=pdf&src-supplier=Avnet; ComponentLink1Description: http://www.ti.com/general/docs/lit/getliterature.tsp?genericPartNumber=DRV8701&&fileType=pdf&src-supplier=Avnet; ComponentLink2URL: http://www.ti.com/lit/ds/symlink/drv8701.pdf?src-supplier=Digi-Key; ComponentLink2Description: http://www.ti.com/lit/ds/symlink/drv8701.pdf?src-supplier=Digi-Key

## Nets that join several sheets
+1V8: [8]-DAC & MIC (C35.2 C36.2 FB3.1 U6.34), [10]-POWER (6 pins)
+3V3: [3]-Debugger_STM32F103 (14 pins), [4]-Ethernet_PHY (10 pins), [5]-Motor Driver_DRV8701 (R17.2), [6]-CH340C (C28.1 U4.4 U4.16), [7]-ADC CHIP (8 pins), [8]-DAC & MIC (11 pins), [9]-STM32F407 (20 pins), [10]-POWER (6 pins), [11]-Motor Driver_DRV8701_2 (R40.2)
+12V: [5]-Motor Driver_DRV8701 (7 pins), [10]-POWER (C76.1 D7.1 D9.1 J12.1), [11]-Motor Driver_DRV8701_2 (7 pins)
DVDD: [5]-Motor Driver_DRV8701 (C25.2 R22.2 R23.2 U3.8), [11]-Motor Driver_DRV8701_2 (C88.2 R45.2 R46.2 U11.8)
EARTH: [4]-Ethernet_PHY (C21.1 R11.1), [10]-POWER (MH1.1)
GND: [3]-Debugger_STM32F103 (20 pins), [4]-Ethernet_PHY (21 pins), [5]-Motor Driver_DRV8701 (12 pins), [6]-CH340C (7 pins), [7]-ADC CHIP (10 pins), [8]-DAC & MIC (25 pins), [9]-STM32F407 (30 pins), [10]-POWER (20 pins), [11]-Motor Driver_DRV8701_2 (12 pins)
COL: [4]-Ethernet_PHY (R9.2 U2.28), [9]-STM32F407 (U8.26)
CRS: [4]-Ethernet_PHY (R10.2 U2.29), [9]-STM32F407 (U8.23)
NetR8_2: [4]-Ethernet_PHY (R8.2 U2.11), [9]-STM32F407 (U8.25)
NetR19_1: [5]-Motor Driver_DRV8701 (R19.1 U3.14), [9]-STM32F407 (U8.45)
NetR22_1: [5]-Motor Driver_DRV8701 (R22.1 U3.9), [9]-STM32F407 (U8.62)
NetR23_1: [5]-Motor Driver_DRV8701 (R23.1 U3.10), [9]-STM32F407 (U8.61)
NetR24_2: [7]-ADC CHIP (R24.2 U5.16), [8]-DAC & MIC (U6.2), [9]-STM32F407 (U8.92)
NetR25_2: [7]-ADC CHIP (R25.2 U5.15), [8]-DAC & MIC (U6.1), [9]-STM32F407 (U8.93)
NetR26_1: [7]-ADC CHIP (R26.1 U5.3), [9]-STM32F407 (U8.55)
NetR42_1: [9]-STM32F407 (U8.66), [11]-Motor Driver_DRV8701_2 (R42.1 U11.14)
NetR45_1: [9]-STM32F407 (U8.59), [11]-Motor Driver_DRV8701_2 (R45.1 U11.9)
NetR46_1: [9]-STM32F407 (U8.58), [11]-Motor Driver_DRV8701_2 (R46.1 U11.10)
NetU1_18: [3]-Debugger_STM32F103 (U1.18), [9]-STM32F407 (U8.76)
NetU1_25: [3]-Debugger_STM32F103 (U1.25 U1.27), [9]-STM32F407 (U8.72)
NetU2_12: [4]-Ethernet_PHY (U2.12), [9]-STM32F407 (U8.16)
NetU2_13: [4]-Ethernet_PHY (U2.13), [9]-STM32F407 (U8.36)
NetU2_14: [4]-Ethernet_PHY (U2.14), [9]-STM32F407 (U8.35)
NetU2_15: [4]-Ethernet_PHY (U2.15), [9]-STM32F407 (U8.34)
NetU2_16: [4]-Ethernet_PHY (U2.16), [9]-STM32F407 (U8.33)
NetU2_18: [4]-Ethernet_PHY (U2.18), [9]-STM32F407 (U8.32)
NetU2_19: [4]-Ethernet_PHY (U2.19), [9]-STM32F407 (U8.24)
NetU2_20: [4]-Ethernet_PHY (U2.20), [9]-STM32F407 (U8.47)
NetU2_22: [4]-Ethernet_PHY (U2.22), [9]-STM32F407 (U8.18)
NetU2_23: [4]-Ethernet_PHY (U2.23), [9]-STM32F407 (U8.48)
NetU2_24: [4]-Ethernet_PHY (U2.24), [9]-STM32F407 (U8.51)
NetU2_25: [4]-Ethernet_PHY (U2.25), [9]-STM32F407 (U8.52)
NetU2_26: [4]-Ethernet_PHY (U2.26), [9]-STM32F407 (U8.17)
NetU2_27: [4]-Ethernet_PHY (U2.27), [9]-STM32F407 (U8.1)
NetU3_11: [5]-Motor Driver_DRV8701 (U3.11), [9]-STM32F407 (U8.30)
NetU3_15: [5]-Motor Driver_DRV8701 (U3.15), [9]-STM32F407 (U8.63)
NetU4_2: [6]-CH340C (U4.2), [9]-STM32F407 (U8.78)
NetU4_3: [6]-CH340C (U4.3), [9]-STM32F407 (U8.79)
NetU4_14: [6]-CH340C (U4.14), [9]-STM32F407 (U8.57)
NetU5_14: [7]-ADC CHIP (U5.14), [9]-STM32F407 (U8.56)
NetU6_32: [8]-DAC & MIC (U6.32), [9]-STM32F407 (U8.54)
NetU6_37: [8]-DAC & MIC (U6.37), [9]-STM32F407 (U8.29)
NetU6_38: [8]-DAC & MIC (U6.38), [9]-STM32F407 (U8.89)
NetU6_39: [8]-DAC & MIC (U6.39), [9]-STM32F407 (U8.80)
NetU6_40: [8]-DAC & MIC (U6.40), [9]-STM32F407 (U8.90)
NetU7_3: [8]-DAC & MIC (U7.3), [9]-STM32F407 (U8.65)
NetU7_4: [8]-DAC & MIC (U7.4), [9]-STM32F407 (U8.53)
NetU8_31: [9]-STM32F407 (U8.31), [11]-Motor Driver_DRV8701_2 (U11.11)
NetU8_60: [9]-STM32F407 (U8.60), [11]-Motor Driver_DRV8701_2 (U11.15)
NTRST_F407: [3]-Debugger_STM32F103 (U1.26), [9]-STM32F407 (5 pins)
PHY_RESET: [4]-Ethernet_PHY (R7.2 S2.3 S2.4 U2.32), [9]-STM32F407 (U8.64)